# Altium schematic sheet main.SchDoc
size A4
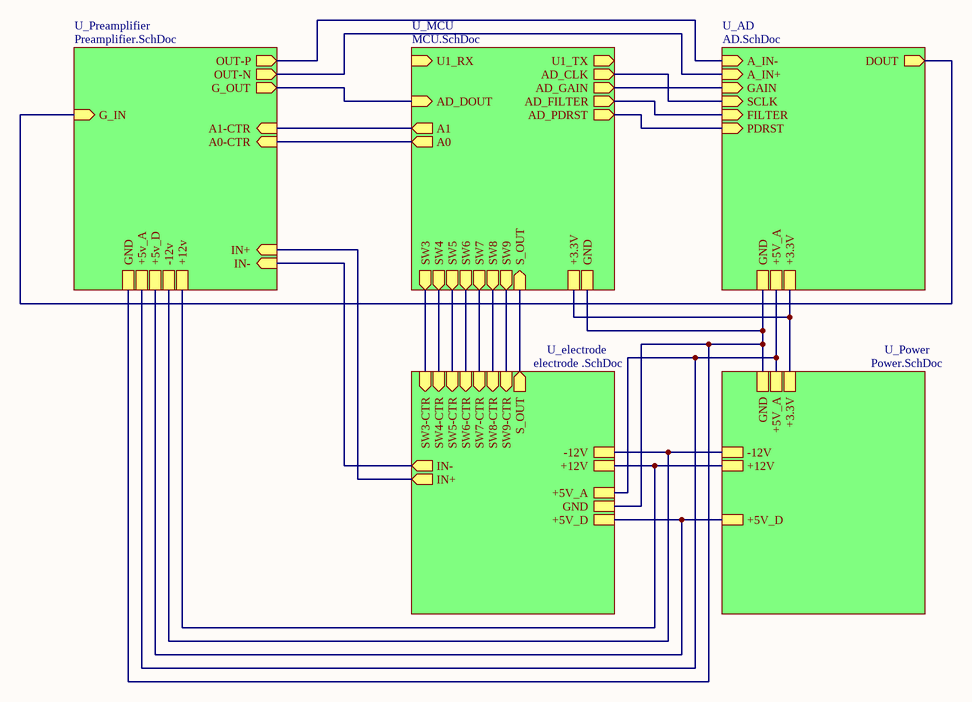
[diagram p0: main.SchDoc]

## Sub-sheets
U_AD = AD.SchDoc: A_IN- (in), A_IN+ (in), PDRST (in), FILTER (in), SCLK (in), DOUT (out), GAIN (in), +3.3V, +5V_A, GND
U_electrode = electrode .SchDoc: SW3-CTR (in), SW4-CTR (in), SW5-CTR (in), SW6-CTR (in), SW7-CTR (in), SW8-CTR (in), SW9-CTR (in), IN+ (out), IN- (out), +12V, GND, +5V_A, S_OUT (out), -12V, +5V_D
U_MCU = MCU.SchDoc: U1_RX (in), U1_TX (out), +3.3V, GND, AD_CLK (out), AD_DOUT (in), AD_GAIN (out), AD_FILTER (out), AD_PDRST (out), S_OUT (in), SW3 (out), SW4 (out), SW5 (out), SW6 (out), SW7 (out), SW8 (out), SW9 (out), A1 (out), A0 (out)
U_Power = Power.SchDoc: +12V, -12V, +5V_A, +3.3V, GND, +5V_D
U_Preamplifier = Preamplifier.SchDoc: IN+ (in), IN- (in), A0-CTR (in), A1-CTR (in), OUT-P (out), OUT-N (out), G_IN (in), G_OUT (out), +12v, -12v, +5v_D, GND, +5v_A

## Nets
(unnamed): sheet U_MCU/+3.3V, sheet U_AD/+3.3V, sheet U_Power/+3.3V
(unnamed): sheet U_MCU/GND, sheet U_AD/GND, sheet U_Power/GND, sheet U_Preamplifier/GND, sheet U_electrode/GND
(unnamed): sheet U_MCU/AD_CLK, sheet U_AD/SCLK
(unnamed): sheet U_MCU/AD_DOUT, sheet U_Preamplifier/G_OUT
(unnamed): sheet U_MCU/AD_GAIN, sheet U_AD/GAIN
(unnamed): sheet U_MCU/AD_FILTER, sheet U_AD/FILTER
(unnamed): sheet U_MCU/AD_PDRST, sheet U_AD/PDRST
(unnamed): sheet U_MCU/S_OUT, sheet U_electrode/S_OUT
(unnamed): sheet U_MCU/SW3, sheet U_electrode/SW3-CTR
(unnamed): sheet U_MCU/SW4, sheet U_electrode/SW4-CTR
(unnamed): sheet U_MCU/SW5, sheet U_electrode/SW5-CTR
(unnamed): sheet U_MCU/SW6, sheet U_electrode/SW6-CTR
(unnamed): sheet U_MCU/SW7, sheet U_electrode/SW7-CTR
(unnamed): sheet U_MCU/SW8, sheet U_electrode/SW8-CTR
(unnamed): sheet U_MCU/SW9, sheet U_electrode/SW9-CTR
(unnamed): sheet U_MCU/A1, sheet U_Preamplifier/A1-CTR
(unnamed): sheet U_MCU/A0, sheet U_Preamplifier/A0-CTR
(unnamed): sheet U_AD/A_IN-, sheet U_Preamplifier/OUT-P
(unnamed): sheet U_AD/A_IN+, sheet U_Preamplifier/OUT-N
(unnamed): sheet U_AD/DOUT, sheet U_Preamplifier/G_IN
(unnamed): sheet U_AD/+5V_A, sheet U_Power/+5V_A, sheet U_Preamplifier/+5v_A, sheet U_electrode/+5V_A
(unnamed): sheet U_Power/+12V, sheet U_Preamplifier/+12v, sheet U_electrode/+12V
(unnamed): sheet U_Power/-12V, sheet U_Preamplifier/-12v, sheet U_electrode/-12V
(unnamed): sheet U_Power/+5V_D, sheet U_Preamplifier/+5v_D, sheet U_electrode/+5V_D
(unnamed): sheet U_Preamplifier/IN+, sheet U_electrode/IN+
(unnamed): sheet U_Preamplifier/IN-, sheet U_electrode/IN-